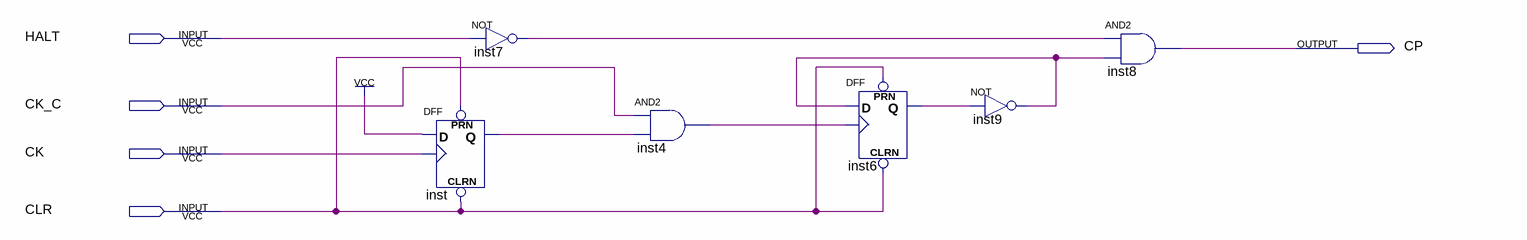
[diagram p0: schematic sheet]
// Quartus schematic START.bdf as structural Verilog: 6 symbols, 5 pins
module START (
  input  HALT,
  input  CK_C,
  input  CK,
  input  CLR,
  output CP
);

  wire inst4_out, inst6_q, inst7_out, inst9_out, inst_q;

  DFF inst (.CLRN(CLR), .CLK(CK), .D(1'b1), .PRN(CLR), .Q(inst_q));
  not inst7 (inst7_out, HALT);
  and inst4 (inst4_out, CK_C, inst_q);
  DFF inst6 (.CLRN(CLR), .CLK(inst4_out), .D(inst9_out), .PRN(CLR), .Q(inst6_q));
  not inst9 (inst9_out, inst6_q);
  and inst8 (CP, inst7_out, inst9_out);
endmodule
